# Altium schematic sheet Elan Chip Interface.schdoc: BROMCOM COMPUTERS PLC
size B; DocumentNumber: PCMCIA MPT1340 TEST PCB; Revision: 2.0; SheetNumber: 1; SheetTotal: 1
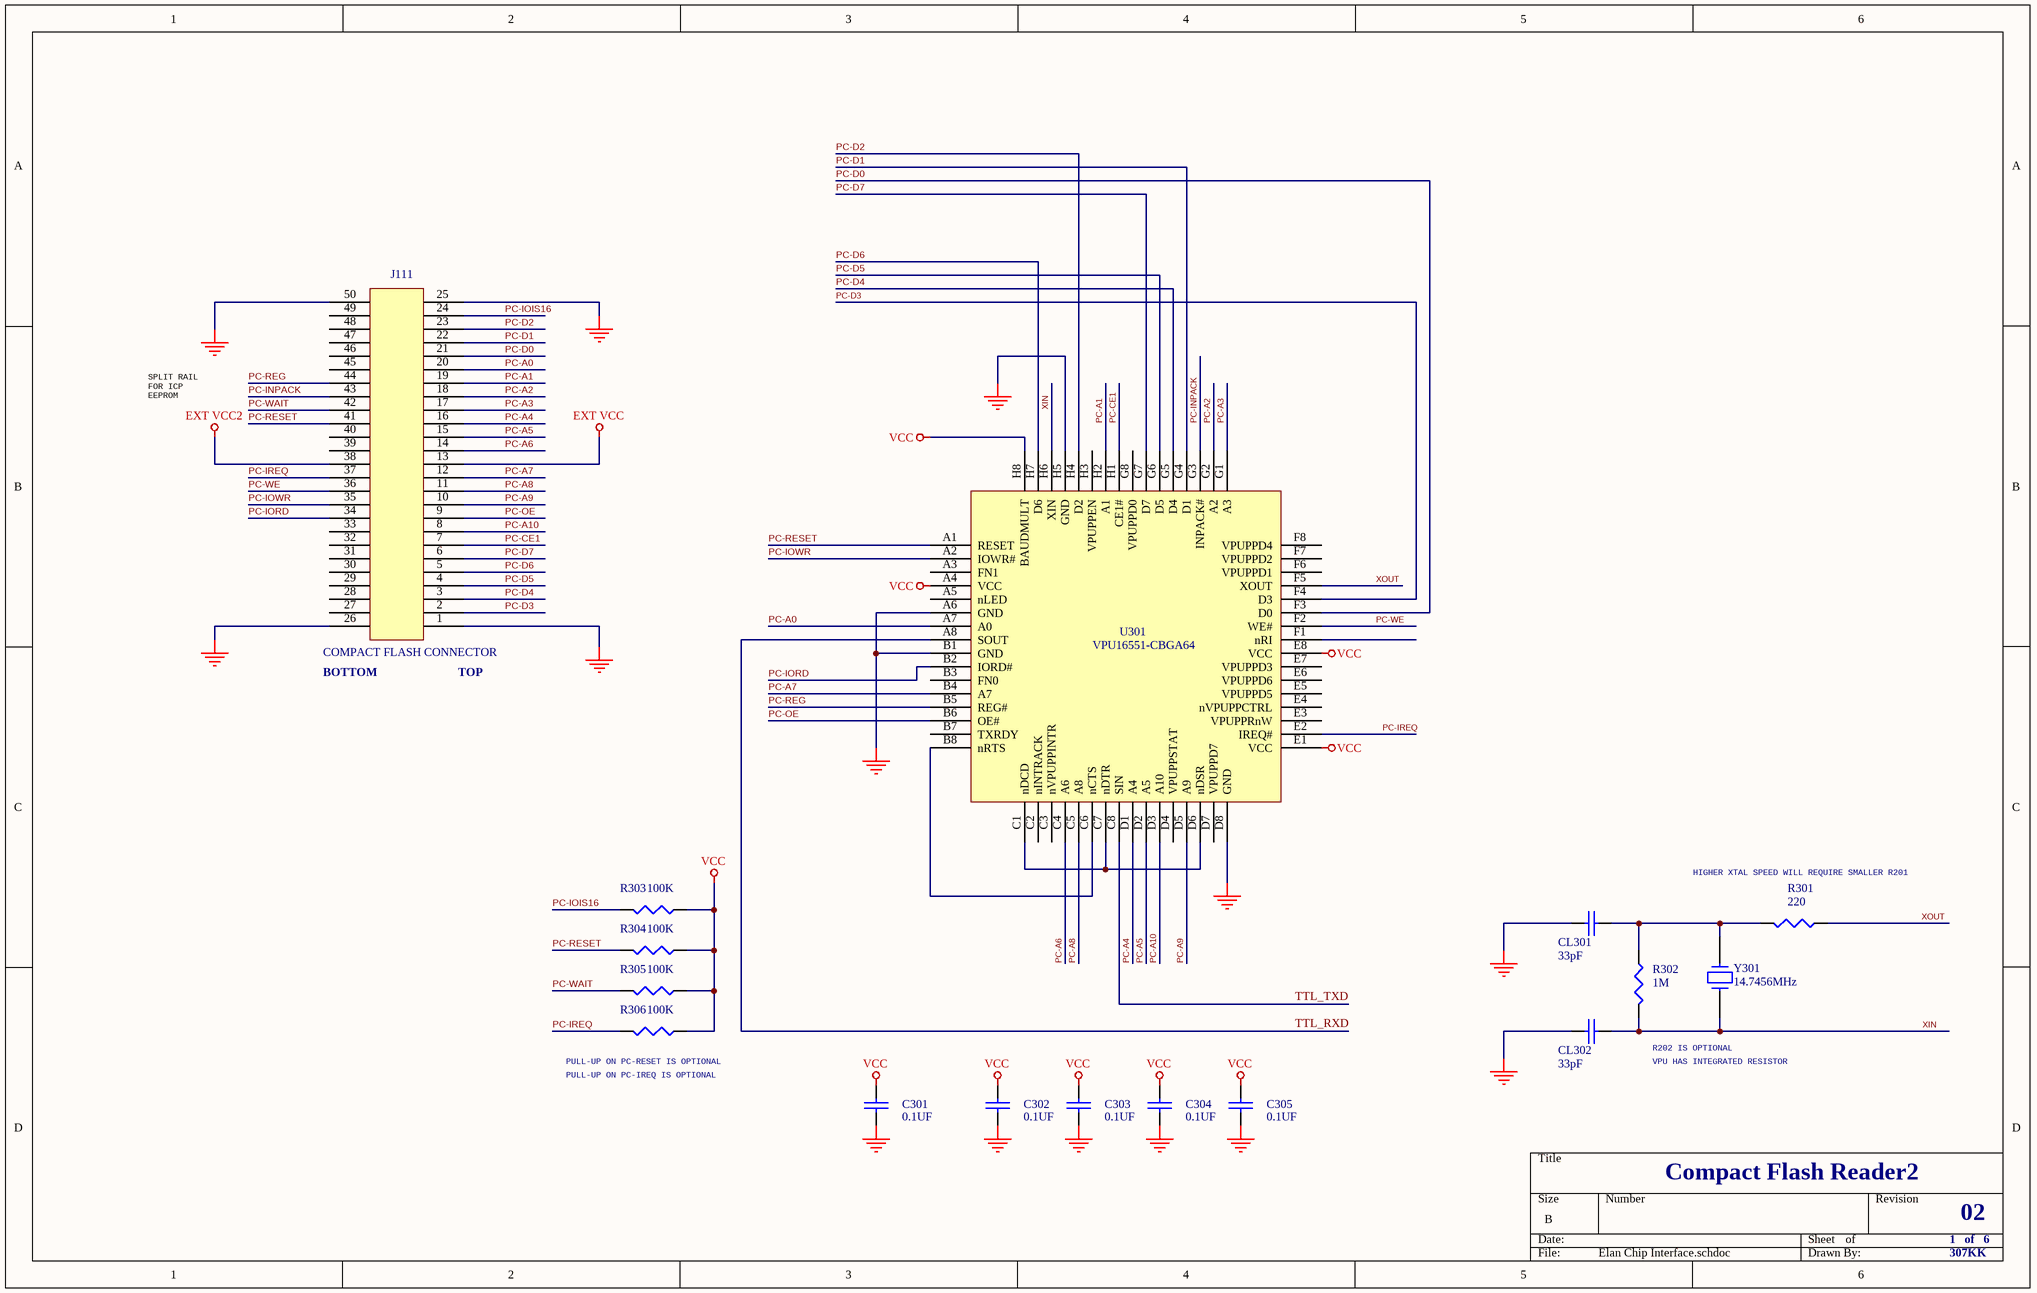
[diagram p0: Elan Chip Interface.schdoc]

## Parts
C301  0.1UF  [0603]
C302  0.1UF  [0603]
C303  0.1UF  [0603]
C304  0.1UF  [0603]
C305  0.1UF  [0603]
CL301  33pF  [0603]
CL302  33pF  [0603]
J111  COMPACT FLASH CONNECTOR
R301  220  [0603]
R302  1M  [0603]
R303  100K  [0603]
R304  100K  [0603]
R305  100K  [0603]
R306  100K  [0603]
U301  VPU16551-CBGA64  [BGA68]
Y301  14.7456MHz  [SMT CRYSTAL]

## Nets
EXT VCC: J111.13
EXT VCC2: J111.38
GND_COM: C301.2 C302.2 C303.2 C304.2 C305.2 CL301.2 CL302.2 J111.1 J111.25 J111.26 J111.50 U301.A6(GND) U301.B1(GND) U301.D8(GND) U301.H5(GND)
VCC: C301.1 C302.1 C303.1 C304.1 C305.1 R303.1 R304.1 R305.1 R306.1 U301.A4(VCC) U301.E1(VCC) U301.E8(VCC) U301.H8(BAUDMULT)
PC-A0: J111.20 U301.A7(A0)
PC-A1: J111.19 U301.H2(A1)
PC-A2: J111.18 U301.G2(A2)
PC-A3: J111.17 U301.G1(A3)
PC-A4: J111.16 U301.D1(A4)
PC-A5: J111.15 U301.D2(A5)
PC-A6: J111.14 U301.C4(A6)
PC-A7: J111.12 U301.B4(A7)
PC-A8: J111.11 U301.C5(A8)
PC-A9: J111.10 U301.D5(A9)
PC-A10: J111.8 U301.D3(A10)
PC-CE1: J111.7 U301.H1(CE1#)
PC-D0: J111.21 U301.F3(D0)
PC-D1: J111.22 U301.G4(D1)
PC-D2: J111.23 U301.H4(D2)
PC-D3: J111.2 U301.F4(D3)
PC-D4: J111.3 U301.G5(D4)
PC-D5: J111.4 U301.G6(D5)
PC-D6: J111.5 U301.H7(D6)
PC-D7: J111.6 U301.G7(D7)
PC-INPACK: J111.43 U301.G3(INPACK#)
PC-IOIS16: J111.24 R303.2
PC-IORD: J111.34 U301.B2(IORD#)
PC-IOWR: J111.35 U301.A2(IOWR#)
PC-IREQ: J111.37 R306.2 U301.E2(IREQ#)
PC-OE: J111.9 U301.B6(OE#)
PC-REG: J111.44 U301.B5(REG#)
PC-RESET: J111.41 R304.2 U301.A1(RESET)
PC-WAIT: J111.42 R305.2
PC-WE: J111.36 U301.F2(WE#)
TTL_RXD: U301.A8(SOUT)
TTL_TXD: U301.C8(SIN)
XIN: CL302.1 R302.2 U301.H6(XIN) Y301.1
XOUT: R301.1 U301.F5(XOUT)
NetCL301_1: CL301.1 R301.2 R302.1 Y301.2
NetU301_B8: U301.B8(nRTS) U301.C6(nCTS)
NetU301_C1: U301.C1(nDCD) U301.C7(nDTR) U301.D6(nDSR)

Not connected (* = marked no-connect by the designer): J111 27 28 29 30 31 32 33 39 40 45 46 47 48 49; U301 A3(FN1) A5(nLED) B3(FN0) B7(TXRDY) C2(nINTRACK) C3(nVPUPPINTR) D4(VPUPPSTAT) D7(VPUPPD7) E3(VPUPPRnW) E4(nVPUPPCTRL) E5(VPUPPD5) E6(VPUPPD6) E7(VPUPPD3) F1(nRI) F6(VPUPPD1) F7(VPUPPD2) F8(VPUPPD4) G8(VPUPPD0) H3(VPUPPEN)

## Notes on the sheet
- SPLIT RAIL
  FOR ICP
  EEPROM
- (near J111) BOTTOM
- (near J111) TOP
- (near R301) HIGHER XTAL SPEED WILL REQUIRE SMALLER R201
- (near R306) PULL-UP ON PC-RESET IS OPTIONAL
- (near R306) PULL-UP ON PC-IREQ IS OPTIONAL
- R202 IS OPTIONAL
- VPU HAS INTEGRATED RESISTOR
- Compact Flash Reader2
- 1   of   6
- 02
- 307KK

## Library data of the parts
C301-C305 CL301 CL302 = CAP: Capacitor
J111 = CON50
R301-R306 = R: Text Field1: 20; Text Field2: 30
Y301 = CRYSTAL